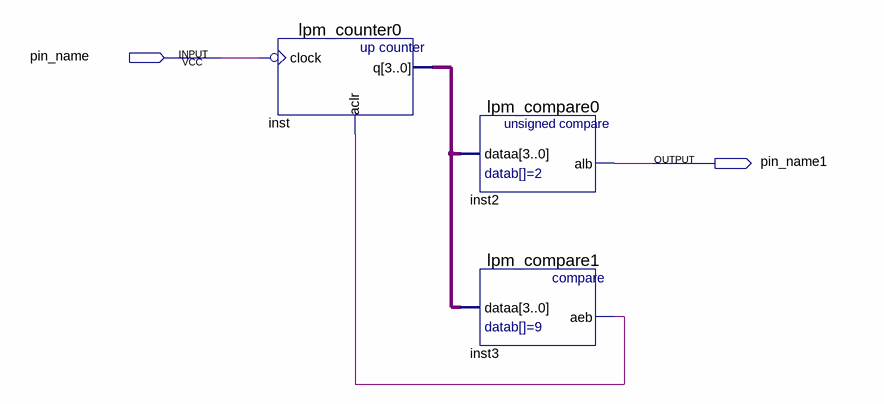
[diagram p0: schematic sheet]
// Quartus schematic Block1.bdf as structural Verilog: 3 symbols, 2 pins
module Block1 (
  input  pin_name,
  output pin_name1
);

  wire inst3_aeb;
  wire [3:0] inst_q;

  lpm_counter0 inst (.clock(~pin_name), .aclr(inst3_aeb), .q(inst_q));
  lpm_compare0 inst2 (.dataa(inst_q), .alb(pin_name1));
  lpm_compare1 inst3 (.dataa(inst_q), .aeb(inst3_aeb));
endmodule
